# Altium schematic sheet AC_SUPPLY.SchDoc
size A4
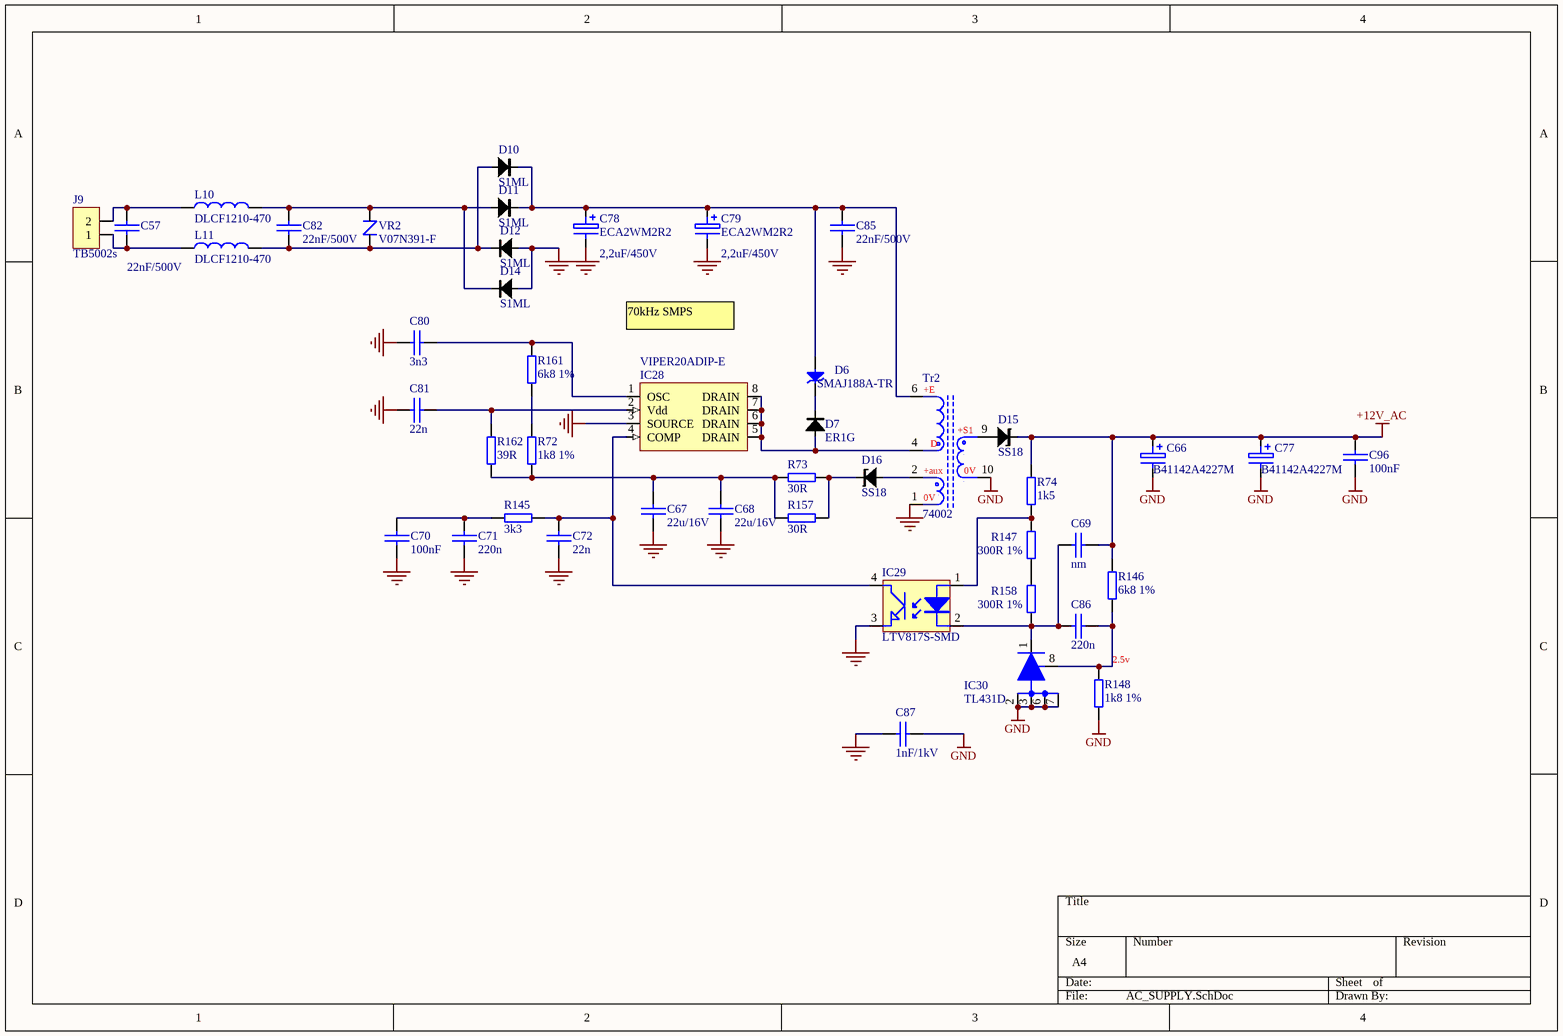
[diagram p0: AC_SUPPLY.SchDoc]

## Parts
C57  22nF/500V  [1206C]
C66  B41142A4227M  [CAP_SMT_EL_5mm_C]
C67  22u/16V  [1206C]
C68  22u/16V  [1206C]
C69  nm  [0402C]
C70  100nF  [0402C]
C71  220n  [0603C]
C72  22n  [0603C]
C77  B41142A4227M  [CAP_SMT_EL_5mm_C]
C78  ECA2WM2R2  value 2,2uF/450V  [RB.2/.4]
C79  ECA2WM2R2  value 2,2uF/450V  [RB.2/.4]
C80  3n3  [0603C]
C81  22n  [0603C]
C82  22nF/500V  [1206C]
C85  22nF/500V  [1206C]
C86  220n  [0603C]
C87  1nF/1kV  [1206C]
C96  100nF  [0402C]
D6  SMAJ188A-TR  [DO-214AA/SMB]
D7  ER1G  [DO-214AA/SMB]
D10  S1ML  [SOD-123]
D11  S1ML  [SOD-123]
D12  S1ML  [SOD-123]
D14  S1ML  [SOD-123]
D15  SS18  [DO-214AC/SMA]
D16  SS18  [DO-214AC/SMA]
IC28  VIPER20ADIP-E  [DIP-8]
IC29  LTV817S-SMD  [SOP_4]
IC30  TL431D  [SO-8]
J9  TB5002s  [tb5002s]
L10  DLCF1210-470  [DLCF1210]
L11  DLCF1210-470  [DLCF1210]
R72  1k8 1%  [0603R]
R73  30R  [0603R]
R74  1k5  [0805R]
R145  3k3  [0603R]
R146  6k8 1%  [0603R]
R147  300R 1%  [0603R]
R148  1k8 1%  [0603R]
R157  30R  [0603R]
R158  300R 1%  [0603R]
R161  6k8 1%  [0603R]
R162  39R  [0805R]
Tr2  74002  [Tr_74002_MYRRA]
VR2  V07N391-F  [Varistor_V07]

## Nets
+12V_AC: C66.1 C69.2 C77.1 C96.1 D15.K R74.1 R146.1
GND: C66.2 C77.2 C87.2 C96.2 IC30.2(A) IC30.3(A) IC30.6(K) IC30.7(A) R148.2 Tr2.10
HGND: C67.2 C68.2 C70.2 C71.2 C72.2 C78.2 C79.2 C80.1 C81.1 C85.1 C87.1 D12.A D14.A IC28.3(SOURCE) IC29.3(C) Tr2.1
NetC57_1: C57.1 J9.1 L11.1
NetC57_2: C57.2 J9.2 L10.1
NetC67_1: C67.1 C68.1 R72.1 R73.1 R157.1 R162.2
NetC69_1: C69.1 C86.1 IC29.2(K) IC30.1(I/O) R158.2
NetC70_1: C70.1 C71.1 R145.1
NetC72_1: C72.1 IC28.4(COMP) IC29.4(E) R145.2
NetC78_1: C78.1 C79.1 C85.2 D6.A D10.K D11.K Tr2.6
NetC80_2: C80.2 IC28.1(OSC) R161.1
NetC81_2: C81.2 IC28.2(Vdd) R162.1
NetC82_1: C82.1 D10.A D12.K L11.2 VR2.2
NetC82_2: C82.2 D11.A D14.K L10.2 VR2.1
NetC86_2: C86.2 IC30.8(REF) R146.2 R148.1
NetD6_K: D6.K D7.K
NetD7_A: D7.A IC28.5(DRAIN) IC28.6(DRAIN) IC28.7(DRAIN) IC28.8(DRAIN) Tr2.4
NetD15_A: D15.A Tr2.9
NetD16_A: D16.A Tr2.2
NetD16_K: D16.K R73.2 R157.2
NetIC29_1: IC29.1(A) R74.2 R147.1
NetR72_2: R72.2 R161.2
NetR147_2: R147.2 R158.1

## Notes on the sheet
- 70kHz SMPS
- (near R148) 2.5v
- (in symbol Tr_74002) +E; +S1; D; +aux; 0V

## Library data of the parts
C57 C82 C85 C87 = CAP_SMD_1206: Capacitor SMD; Supplier 1: Newark; Supplier Part Number 1: 90R7810
C66 C77 = CAP_ELECTRO_SMD_C: Electrolytic Capacitor
C67 C68 = CAP_SMD_0805: Capacitor SMD
C69 C70 C96 = CAP_SMD_0402: Capacitor SMD; Supplier 1: Newark; Supplier Part Number 1: 14T3275
C71 C72 C80 C81 C86 = CAP_SMD_0603: Capacitor SMD
C78 C79 = CAP_ELECTRO_10mm: Electrolytic Capacitor
D6 = D_TVS_600W: TVS, 200V; Part Number: P6KE200A; Part Description: Uni-Directional Transient Voltage Suppressor Diode; Manufacturer: FAIRCHILD SEMICONDUCTOR; Power: 600W; Table: Diodes; Component Kind: Standard; Component Type: Standard; Device: SMAJ188A-TR; Footprint: DO-15; PackageDescription: DO-15, Diode, Axial, Body 7.62 x 3.56mm (LxDia. Max), Pin spacing 13.97mm; Voltage: 200V; Manufacturer Part Number: P6KE200A; Pin Count: 2; Case: DO-15; Mounted: Yes; Socket: No; SMD: No; ComponentHeight: 3.56mm; HelpURL: \\cern.ch\dfs\Applications\Altium\Datasheets\P6KE6V8A.pdf; Author: CERN DEM JMW; CreateDate: 2008-10-01; LatestRevisionDate: 2008-10-01
D7 = D_ER1G: 1A, 400V, 35ns
D10-D12 D14 = D_S1ML: 1A, 1000V, 1.8us
D15 D16 = D_shottky_SS14_18: shottky diode (Maritex)
IC28 = PWM_VIPER20: 20W SMPS PRIMARY I.C.
IC29 = OPTO-LTV817S: transoptor
IC30 = REF_TL431_SO8: Voltage reference
J9 = CON_TB2: Terminal Block
L10 L11 = L_CHOKE_1210: Inductor (maritex)
R72 R73 R145-R148 R157 R158 R161 = RES_0603: SMD Resistor
  R73 R157: Supplier 1: Newark; Supplier Part Number 1: 39K0073
R74 R162 = RES_0805: SMD Resistor
Tr2 = Tr_74002: 6W 12V flyback transformer (MYRRA)
VR2 = Varistor V07N: varistor 7mm (Maritex)